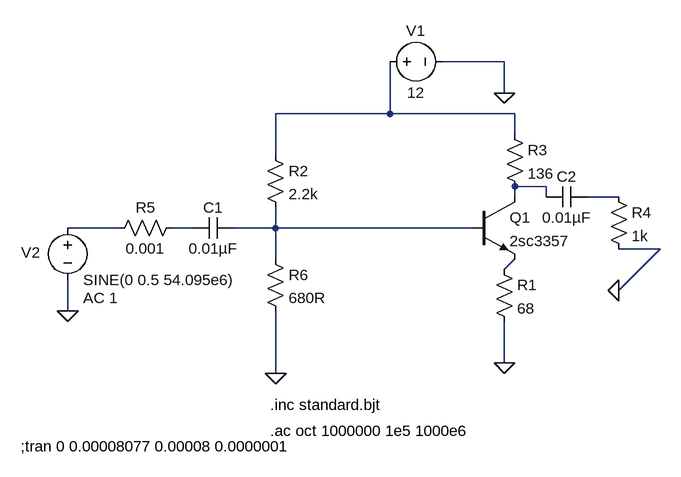
[diagram p0: schematic singl-BJT-amp-gain-common-E.asc]
singl-BJT-amp-gain-common-E.asc, the LTspice schematic file:
Version 4
SHEET 1 880 680
WIRE 368 -112 272 -112
WIRE 368 -64 368 -112
WIRE 192 -32 192 -112
WIRE 192 -32 16 -32
WIRE 384 -32 192 -32
WIRE 384 0 384 -32
WIRE 16 32 16 -32
WIRE 432 80 384 80
WIRE 384 96 384 80
WIRE 432 96 432 80
WIRE 544 96 496 96
WIRE -224 144 -304 144
WIRE -112 144 -144 144
WIRE 16 144 16 112
WIRE 16 144 -48 144
WIRE 320 144 16 144
WIRE 608 176 544 176
WIRE 16 192 16 144
WIRE 368 208 384 192
WIRE 544 240 608 176
WIRE -304 272 -304 224
WIRE 368 352 368 288
WIRE 16 368 16 272
FLAG 368 352 0
FLAG 368 -64 0
FLAG -304 272 0
FLAG 16 368 0
FLAG 544 240 0
SYMBOL res 352 192 R0
SYMATTR InstName R1
SYMATTR Value 68
SYMATTR SpiceLine tol=1% pwr=1
SYMBOL npn 320 96 R0
SYMATTR InstName Q1
SYMATTR Value 2sc3357
SYMBOL voltage 176 -112 R270
WINDOW 0 32 56 VTop 2
WINDOW 3 -32 56 VBottom 2
WINDOW 123 0 0 Left 2
WINDOW 39 4 56 VTop 2
SYMATTR InstName V1
SYMATTR Value 12
SYMBOL voltage -304 128 R0
WINDOW 123 24 124 Left 2
WINDOW 39 0 0 Left 2
WINDOW 0 -71 54 Left 2
SYMATTR Value2 AC 1
SYMATTR InstName V2
SYMATTR Value SINE(0 0.5 54.095e6)
SYMBOL res 528 80 R0
SYMATTR InstName R4
SYMATTR Value 1k
SYMATTR SpiceLine tol=1% pwr=1
SYMBOL res -240 160 R270
WINDOW 0 32 56 VTop 2
WINDOW 3 0 56 VBottom 2
SYMATTR InstName R5
SYMATTR Value 0.001
SYMATTR SpiceLine tol=1% pwr=1
SYMBOL res 0 176 R0
SYMATTR InstName R6
SYMATTR Value 680R
SYMBOL res 0 16 R0
SYMATTR InstName R2
SYMATTR Value 2.2k
SYMATTR SpiceLine tol=1% pwr=1
SYMBOL cap -48 160 M270
WINDOW 0 32 32 VTop 2
WINDOW 3 0 32 VBottom 2
SYMATTR InstName C1
SYMATTR Value 0.01µF
SYMBOL res 368 -16 R0
SYMATTR InstName R3
SYMATTR Value 136
SYMBOL cap 432 80 M90
WINDOW 0 0 32 VBottom 2
WINDOW 3 32 32 VTop 2
SYMATTR InstName C2
SYMATTR Value 0.01µF
TEXT 8 416 Left 2 !.inc standard.bjt
TEXT 8 456 Left 2 !.ac oct 1000000 1e5 1000e6
TEXT -376 480 Left 2 !;tran 0 0.00008077 0.00008 0.0000001

The netlist it stands for:
* singl-BJT-amp-gain-common-E.asc
R1 N007 0 68 tol=1% pwr=1
Q1 N002 N006 N007 0 2sc3357
V1 N001 0 12
V2 N004 0 SINE(0 0.5 54.095e6) AC 1
R4 N003 0 1k tol=1% pwr=1
R5 N004 N005 0.001 tol=1% pwr=1
R6 N006 0 680R
R2 N001 N006 2.2k tol=1% pwr=1
C1 N006 N005 0.01µF
R3 N001 N002 136
C2 N002 N003 0.01µF
.model NPN NPN
.model PNP PNP
.lib standard.bjt
.inc standard.bjt
.ac oct 1000000 1e5 1000e6
;tran 0 0.00008077 0.00008 0.0000001
.backanno
.end